# Altium schematic sheet [03] - Arduino_pcb_Schematic.SchDoc (part 1 of 3)
size A2; DocumentNumber: 3; SheetNumber: 3; SheetTotal: 4
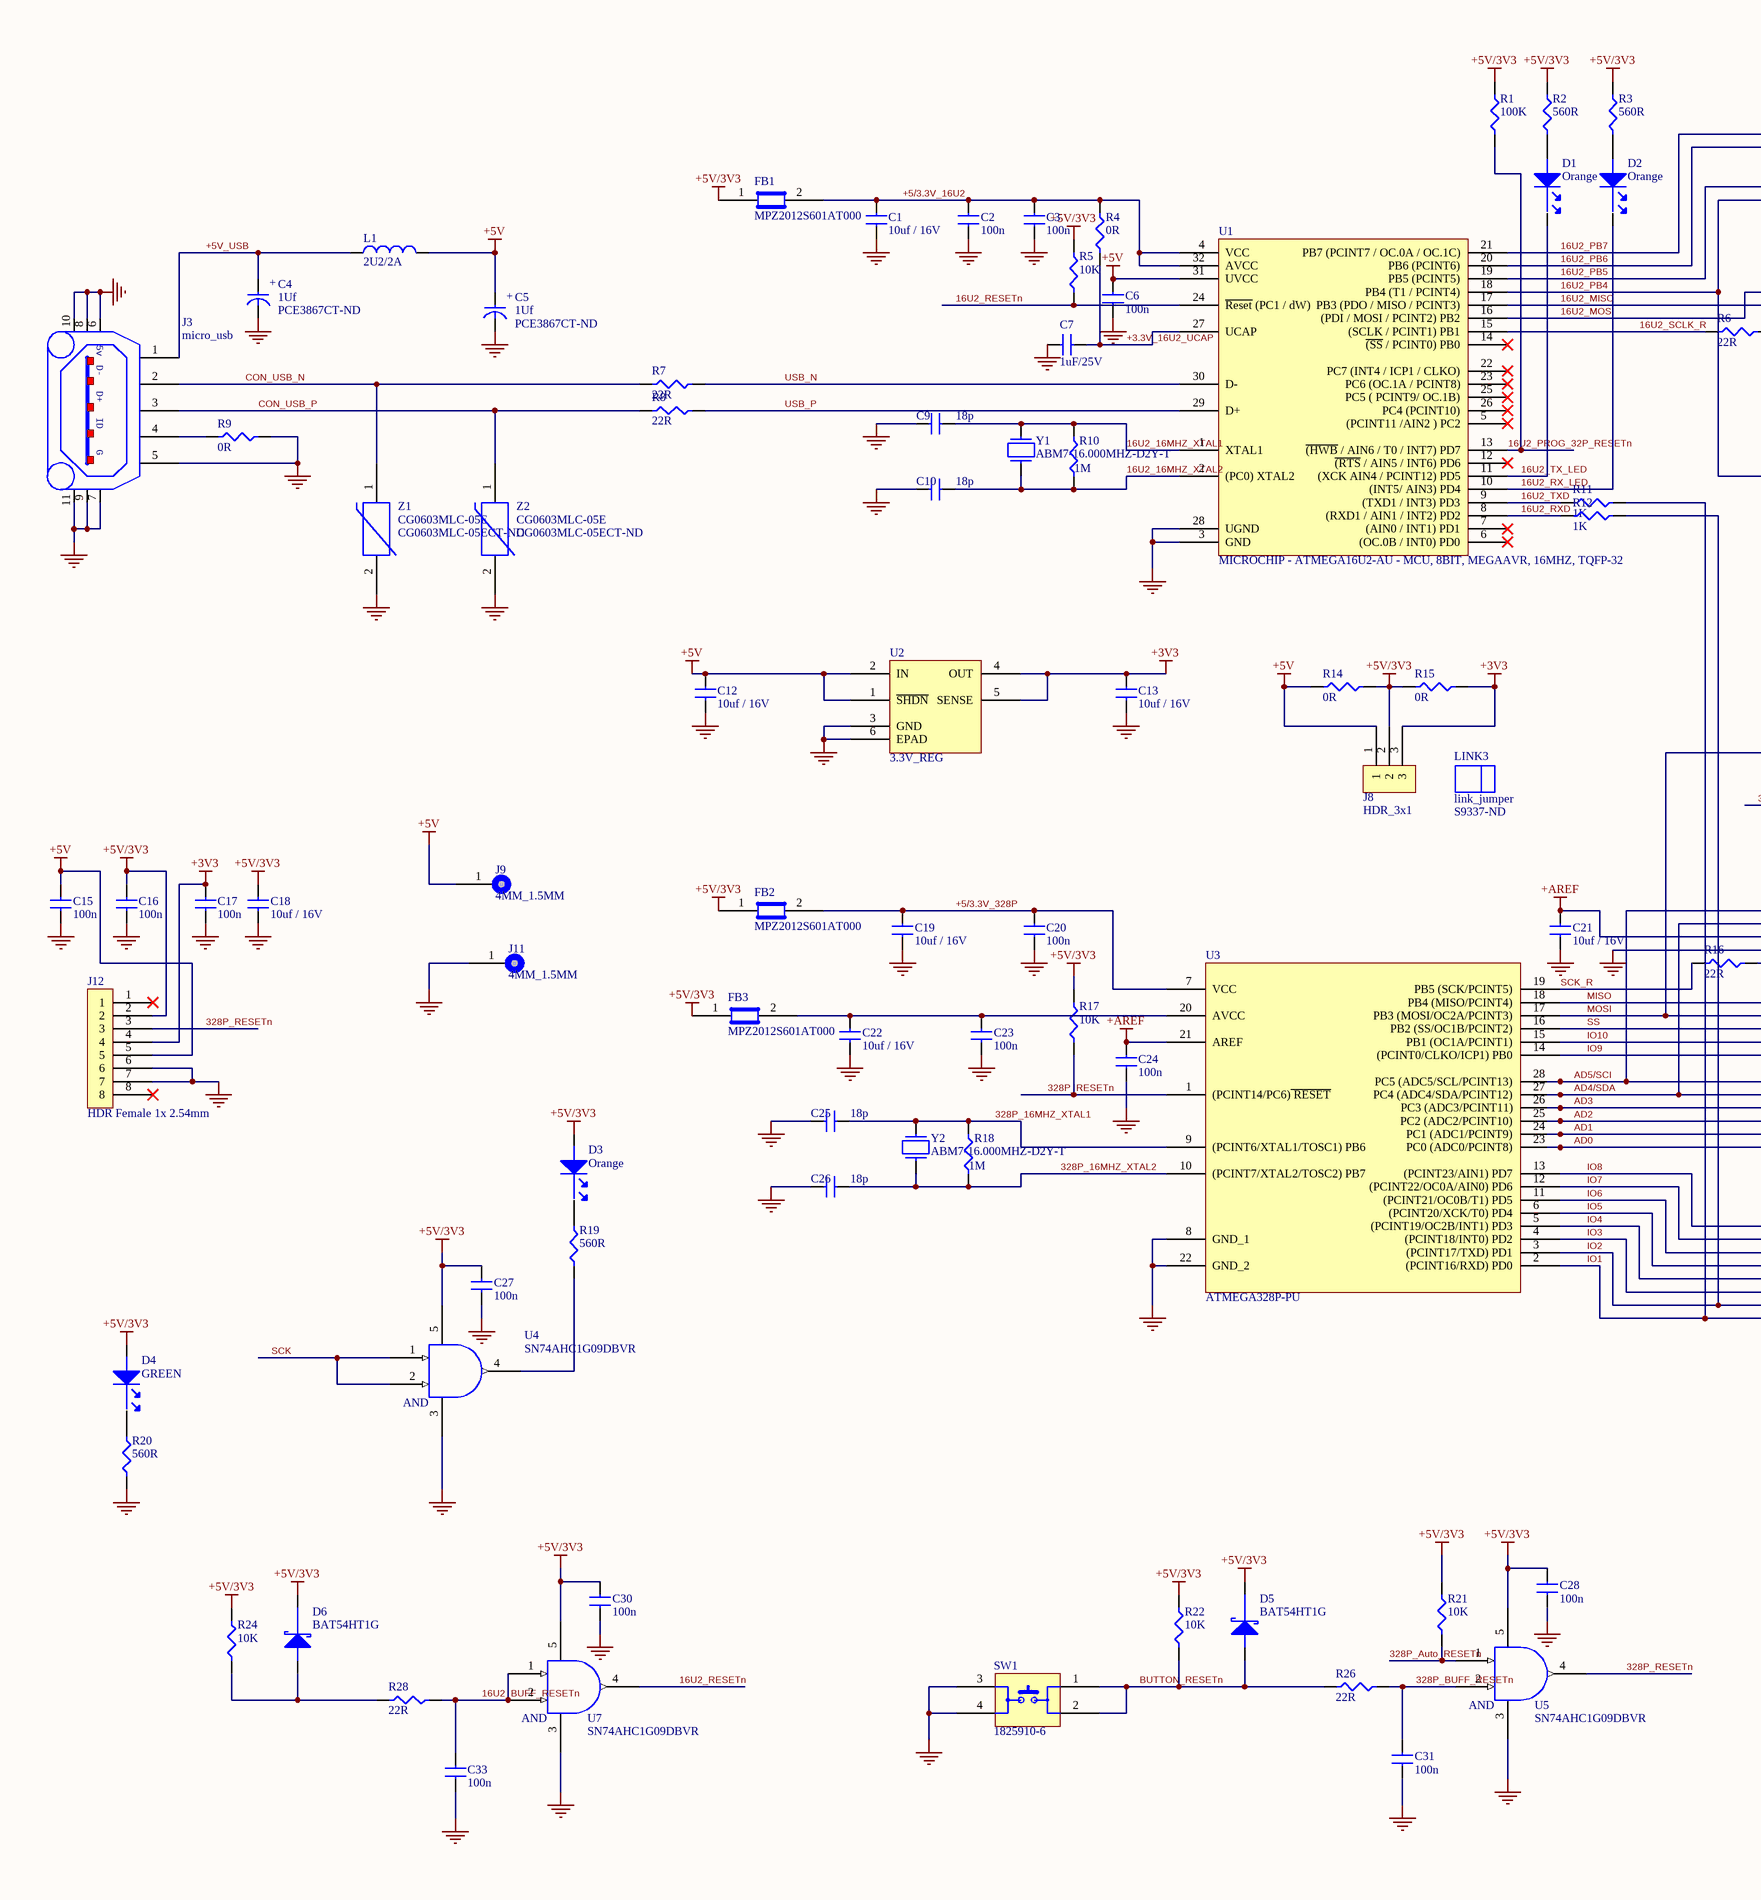
[diagram p0: [03] - Arduino_pcb_Schematic.SchDoc, left]
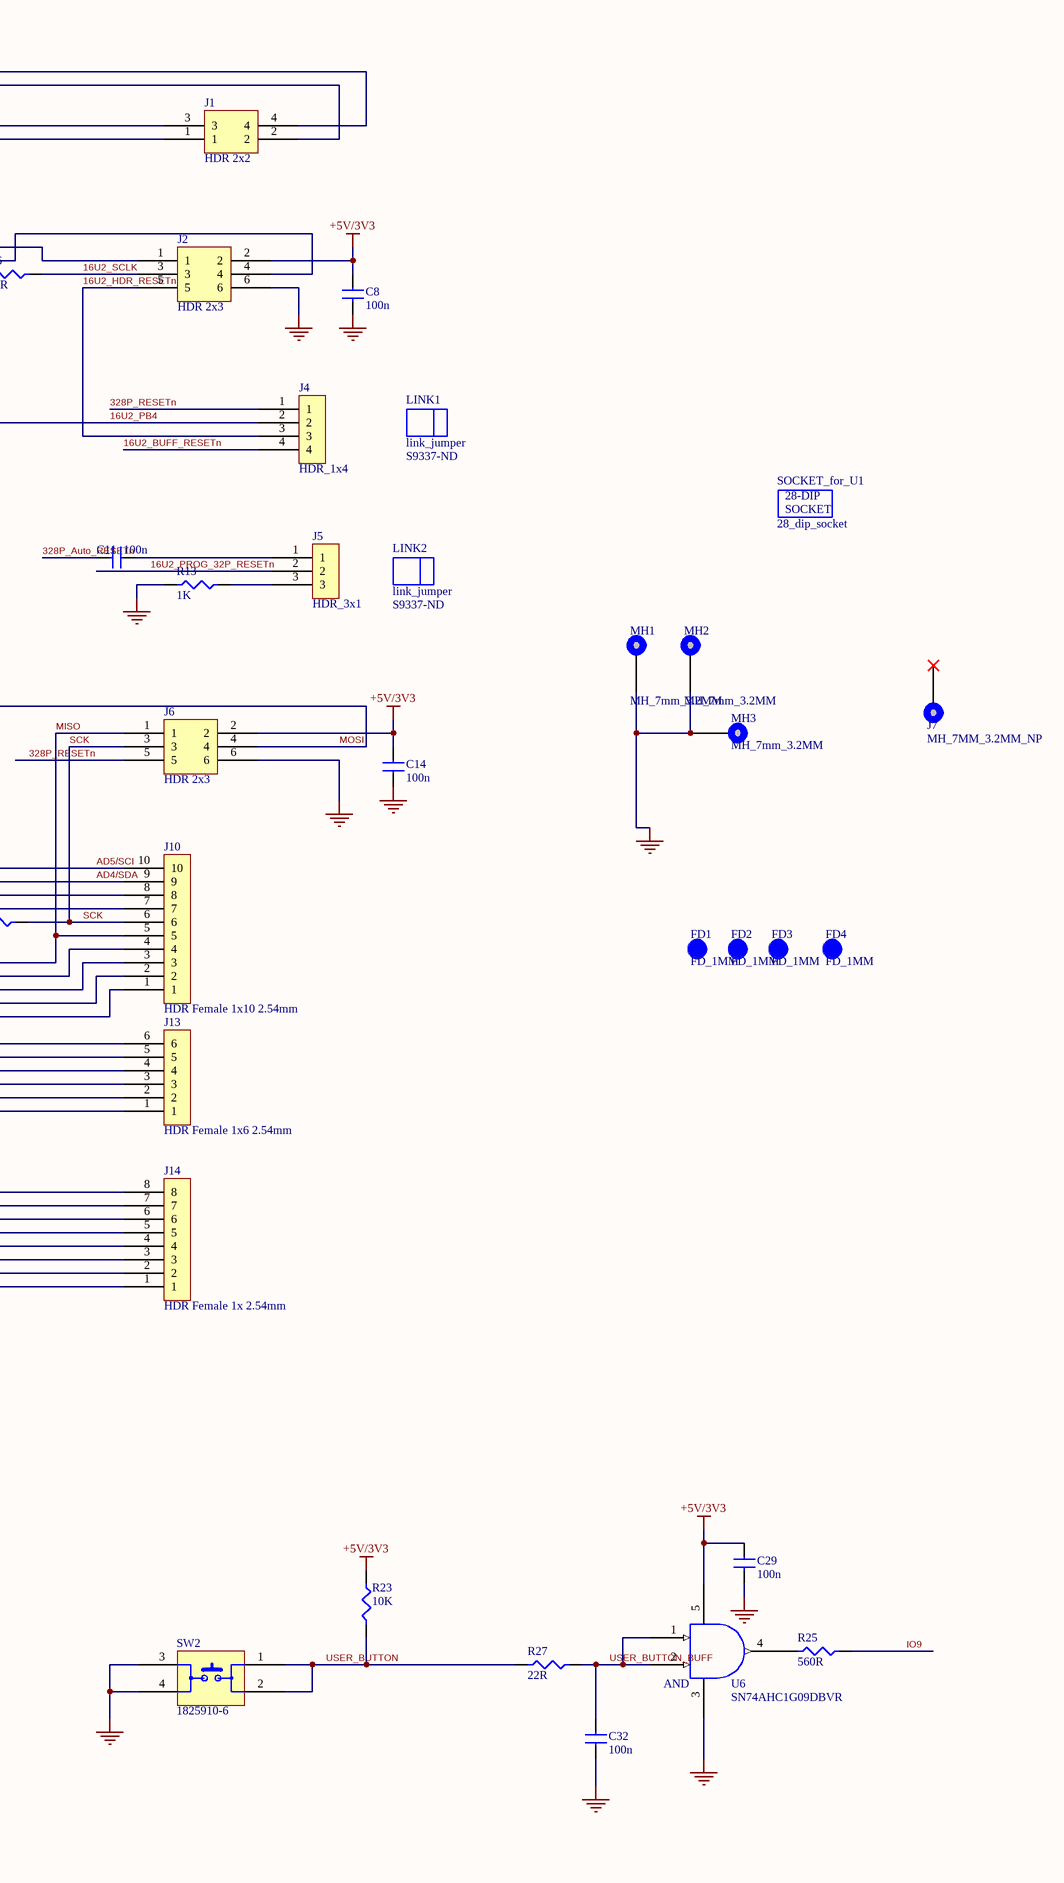
[diagram p1: [03] - Arduino_pcb_Schematic.SchDoc, right]

## Parts
C1  10uf / 16V  [C0805_145]
C2  100n  [C0805_95]
C3  100n  [C0805_95]
C4  1Uf  Supplier Part Number 1: PCE3867CT-ND  [C_ALIMUNUM_C_Size]
C5  1Uf  Supplier Part Number 1: PCE3867CT-ND  [C_ALIMUNUM_C_Size]
C6  100n  [C0805_95]
C7  1uF/25V  [C0805_145]
C8  100n  [C0805_95]
C9  18p  [C0805_95]
C10  18p  [C0805_95]
C11  100n  [C0805_95]
C12  10uf / 16V  [C0805_145]
C13  10uf / 16V  [C0805_145]
C14  100n  [C0805_95]
C15  100n  [C0805_95]
C16  100n  [C0805_95]
C17  100n  [C0805_95]
C18  10uf / 16V  [C0805_145]
C19  10uf / 16V  [C0805_145]
C20  100n  [C0805_95]
C21  10uf / 16V  [C0805_145]
C22  10uf / 16V  [C0805_145]
C23  100n  [C0805_95]
C24  100n  [C0805_95]
C25  18p  [C0805_95]
C26  18p  [C0805_95]
C27  100n  [C0805_95]
C28  100n  [C0805_95]
C29  100n  [C0805_95]
C30  100n  [C0805_95]
C31  100n  [C0805_95]
C32  100n  [C0805_95]
C33  100n  [C0805_95]
D1  Orange  [LED0603]
D2  Orange  [LED0603]
D3  Orange  [LED0603]
D4  GREEN  [LED0603]
D5  BAT54HT1G  [BAT54HT1G]
D6  BAT54HT1G  [BAT54HT1G]
FB1  MPZ2012S601AT000  [FB0805_85]
FB2  MPZ2012S601AT000  [FB0805_85]
FB3  MPZ2012S601AT000  [FB0805_85]
FD1  FD_1MM  [FD_408120]  (no BOM)
FD2  FD_1MM  [FD_408120]  (no BOM)
FD3  FD_1MM  [FD_408120]  (no BOM)
FD4  FD_1MM  [FD_408120]  (no BOM)
J1  HDR 2x2  [HDR_2x2_2.54mm]
J2  HDR 2x3  [HDR_3x2_2.54mm]
J3  micro_usb  [MICRO_USB]
J4  HDR_1x4  [HDR_Female_1x4_2.54mm]
J5  HDR_3x1  [HDR_Female_1x3_2.54mm]
J6  HDR 2x3  [HDR_3x2_2.54mm]
J7  MH_7MM_3.2MM_NP  [MH_7mm_3.2MM_NP]
J8  HDR_3x1  [HDR_Female_1x3_2.54mm]
J9  4MM_1.5MM  [PAD_WITH_HOLE_4mm_1.5mm]  (no BOM)
J10  HDR Female 1x10 2.54mm  [HDR_Female_1x10_2.54mm]
J11  4MM_1.5MM  [PAD_WITH_HOLE_4mm_1.5mm]  (no BOM)
J12  HDR Female 1x 2.54mm  [HDR_Female_1x8_2.54mm]
J13  HDR Female 1x6 2.54mm  [HDR_Female_1x 6_2.54mm]
J14  HDR Female 1x 2.54mm  [HDR_Female_1x8_2.54mm]
L1  2U2/2A  [C2120_L]
LINK1  link_jumper  Supplier Part Number 1: S9337-ND  (mechanical)
LINK2  link_jumper  Supplier Part Number 1: S9337-ND  (mechanical)
LINK3  link_jumper  Supplier Part Number 1: S9337-ND  (mechanical)
MH1  MH_7mm_3.2MM  [MH_7mm_3.2MM]  (no BOM)
MH2  MH_7mm_3.2MM  [MH_7mm_3.2MM]  (no BOM)
MH3  MH_7mm_3.2MM  [MH_7mm_3.2MM]  (no BOM)
R1  100K  [R0805]
R2  560R  [R0805]
R3  560R  [R0805]
R4  0R  [R0805]
R5  10K  [R0805]
R6  22R  [R0805]
R7  22R  [R0805]
R8  22R  [R0805]
R9  0R  [R0805]
R10  1M  [R0805]
R11  1K  [R0805]
R12  1K  [R0805]
R13  1K  [R0805]
R14  0R  [R0805]
R15  0R  [R0805]
R16  22R  [R0805]
R17  10K  [R0805]
R18  1M  [R0805]
R19  560R  [R0805]
R20  560R  [R0805]
R21  10K  [R0805]
R22  10K  [R0805]
R23  10K  [R0805]
R24  10K  [R0805]
R25  560R  [R0805]
R26  22R  [R0805]
R27  22R  [R0805]
R28  22R  [R0805]
SOCKET_for_U1  28_dip_socket  [DIP_28_Socket]
SW1  1825910-6  [SW_1825910-6]
SW2  1825910-6  [SW_1825910-6]
U1  MICROCHIP - ATMEGA16U2-AU - MCU, 8BIT, MEGAAVR, 16MHZ, TQFP-32  [TQFB32]
U2  3.3V_REG  [DCQR_PDSO_3.3]
U3  ATMEGA328P-PU  [28_DIP_7.62mm]
U4  SN74AHC1G09DBVR  [DBV_SOT_23_5]
U5  SN74AHC1G09DBVR  [DBV_SOT_23_5]
U6  SN74AHC1G09DBVR  [DBV_SOT_23_5]
U7  SN74AHC1G09DBVR  [DBV_SOT_23_5]
Y1  ABM7-16.000MHZ-D2Y-T  [ABM7_BIG]
Y2  ABM7-16.000MHZ-D2Y-T  [ABM7_BIG]
Z1  CG0603MLC-05E  Supplier Part Number 1: CG0603MLC-05ECT-ND  [R0603]
Z2  CG0603MLC-05E  Supplier Part Number 1: CG0603MLC-05ECT-ND  [R0603]

## Nets
+3V3: C13.2 C17.2 J8.3 J12.4 R15.2 U2.4(OUT) U2.5(SENSE)
+5V: C5.1 C6.2 C12.2 C15.2 J8.1 J9.1 J12.5 L1.2 R14.1 U1.31(UVCC) U2.1(~{SHDN}) U2.2(IN)
+5V/3V3: C8.2 C14.2 C16.2 C18.2 C27.2 C28.2 C29.2 C30.2 D3.2(Anode) D4.2(Anode) D5.1(Cathode) D6.1(Cathode) FB1.1 FB2.1 FB3.1 J2.2 J6.2 J8.2 J12.2 R1.2 R2.2 R3.2 R5.1 R14.2 R15.1 R17.2 R21.2 R22.2 R23.2 R24.2 U4.5 U5.5 U6.5 U7.5
+AREF: C21.2 C24.2 J10.8 U3.21(AREF)
GND: C1.1 C2.1 C3.1 C4.2 C5.2 C6.1 C7.1 C8.1 C9.1 C10.1 C12.1 C13.1 C14.1 C15.1 C16.1 C17.1 C18.1 C19.1 C20.1 C21.1 C22.1 C23.1 C24.1 C25.1 C26.1 C27.1 C28.1 C29.1 C30.1 C31.1 C32.1 C33.1 J2.6 J3.5 J3.6 J3.7 J3.8 J3.9 J3.10 J3.11 J6.6 J10.7 J11.1 J12.6 J12.7 MH1.1 MH2.1 MH3.1 R9.2 R13.1 R20.1 SW1.3 SW1.4 SW2.3 SW2.4 U1.3(GND) U1.28(UGND) U2.3(GND) U2.6(EPAD) U3.8(GND_1) U3.22(GND_2) U4.3 U5.3 U6.3 U7.3 Z1.2 Z2.2
16U2_16MHZ_XTAL1: C9.2 R10.2 U1.1(XTAL1) Y1.2
16U2_16MHZ_XTAL2: C10.2 R10.1 U1.2((PC0)_XTAL2) Y1.1
16U2_BUFF_RESETn: C33.2 J4.4 R28.2 U7.1 U7.2
16U2_HDR_RESETn: J2.5 J4.3
16U2_MISO: J2.1 U1.17(PB3_(PDO_/_MISO_/_PCINT3))
16U2_MOSI: J2.4 U1.16((PDI_/_MOSI_/_PCINT2)_PB2)
16U2_PB4: J1.1 J4.2 U1.18(PB4_(T1_/_PCINT4))
16U2_PB5: J1.3 U1.19(PB5_(PCINT5))
16U2_PB6: J1.2 U1.20(PB6_(PCINT6))
16U2_PB7: J1.4 U1.21(PB7_(PCINT7_/_OC.0A_/_OC.1C))
16U2_PROG_32P_RESETn: J5.2 R1.1 U1.13(~{(HWB}_/_AIN6_/_T0_/_INT7)_PD7)
16U2_RESETn: R5.2 U1.24(~{Reset}_(PC1_/_dW)) U7.4
16U2_RX_LED: D2.1(Cathode) U1.10((INT5/_AIN3)_PD4)
16U2_RXD: R12.1 U1.8((RXD1_/_AIN1_/_INT2)_PD2)
16U2_SCLK: J2.3 R6.2
16U2_SCLK_R: R6.1 U1.15((SCLK_/_PCINT1)_PB1)
16U2_TX_LED: D1.1(Cathode) U1.11((XCK_AIN4_/_PCINT12)_PD5)
16U2_TXD: R11.1 U1.9((TXD1_/_INT3)_PD3)
328P_16MHZ_XTAL1: C25.2 R18.2 U3.9((PCINT6/XTAL1/TOSC1)_PB6) Y2.2
328P_16MHZ_XTAL2: C26.2 R18.1 U3.10((PCINT7/XTAL2/TOSC2)_PB7) Y2.1
328P_Auto_RESETn: C11.1 R21.1 U5.1
328P_BUFF_RESETn: C31.2 R26.2 U5.2
328P_RESETn: J4.1 J6.5 J12.3 R17.1 U3.1((PCINT14/PC6)~{_RESET}) U5.4
+3.3V_16U2_UCAP: C7.2 R4.1 U1.27(UCAP)
+5/3.3V_16U2: C1.2 C2.2 C3.2 FB1.2 R4.2 U1.4(VCC) U1.32(AVCC)
+5/3.3V_328P: C19.2 C20.2 FB2.2 U3.7(VCC)
+5V_USB: C4.1 J3.1 L1.1
AD0: J13.1 U3.23(PC0_(ADC0/PCINT8))
AD1: J13.2 U3.24(PC1_(ADC1/PCINT9))
AD2: J13.3 U3.25(PC2_(ADC2/PCINT10))
AD3: J13.4 U3.26(PC3_(ADC3/PCINT11))
AD4/SDA: J10.9 J13.5 U3.27(PC4_(ADC4/SDA/PCINT12))
AD5/SCI: J10.10 J13.6 U3.28(PC5_(ADC5/SCL/PCINT13))
BUTTON_RESETn: D5.2(Anode) R22.1 R26.1 SW1.1 SW1.2
CON_USB_N: J3.2 R7.1 Z1.1
CON_USB_P: J3.3 R8.1 Z2.1
IO1: J14.1 R11.2 U3.2((PCINT16/RXD)_PD0)
IO2: J14.2 R12.2 U3.3((PCINT17/TXD)_PD1)
IO3: J14.3 U3.4((PCINT18/INT0)_PD2)
IO4: J14.4 U3.5((PCINT19/OC2B/INT1)_PD3)
IO5: J14.5 U3.6((PCINT20/XCK/T0)_PD4)
IO6: J14.6 U3.11((PCINT21/OC0B/T1)_PD5)
IO7: J14.7 U3.12((PCINT22/OC0A/AIN0)_PD6)
IO8: J14.8 U3.13((PCINT23/AIN1)_PD7)
IO9: J10.1 R25.2 U3.14((PCINT0/CLKO/ICP1)_PB0)
IO10: J10.2 U3.15(PB1_(OC1A/PCINT1))
MISO: J6.1 J10.5 U3.18(PB4_(MISO/PCINT4))
MOSI: J6.4 J10.4 U3.17(PB3_(MOSI/OC2A/PCINT3))
SCK: J6.3 J10.6 R16.2 U4.1 U4.2
SCK_R: R16.1 U3.19(PB5_(SCK/PCINT5))
SS: J10.3 U3.16(PB2_(SS/OC1B/PCINT2))
USB_N: R7.2 U1.30(D-)
USB_P: R8.2 U1.29(D+)
USER_BUTTON: R23.1 R27.1 SW2.1 SW2.2
USER_BUTTON_BUFF: C32.2 R27.2 U6.1 U6.2
NetC11_2: C11.2 J5.1
NetC22_2: C22.2 C23.2 FB3.2 U3.20(AVCC)
NetD1_2: D1.2(Anode) R2.1
NetD2_2: D2.2(Anode) R3.1
NetD3_1: D3.1(Cathode) R19.2
NetD4_1: D4.1(Cathode) R20.2
NetD6_2: D6.2(Anode) R24.1 R28.1
NetJ3_4: J3.4 R9.1
NetJ5_3: J5.3 R13.2
NetR19_1: R19.1 U4.4
NetR25_1: R25.1 U6.4

Not connected (* = marked no-connect by the designer): J7 1(_)*; J12 1* 8*; U1 5((PCINT11_/AIN2_)_PC2)* 6((OC.0B_/_INT0)_PD0)* 7((AIN0_/_INT1)_PD1)* 12(~{(RTS}_/_AIN5_/_INT6)_PD6)* 14(~{(SS}_/_PCINT0)_PB0)* 22(PC7_(INT4_/_ICP1_/_CLKO))* 23(PC6_(OC.1A_/_PCINT8))* 25(PC5_(_PCINT9/_OC.1B))* 26(PC4_(PCINT10))*